# Altium schematic sheet [02] - Module Connector.SchDoc: Module Connector
size A3; Date: N.A.; ApprovedBy: N.A.; CheckedBy: N.A.; Author: N.A.; CompanyName: Johannes Berndorfer; DrawnBy: JBE; Organization: N.A.; Address1: Konrad Grefe Gasse 22; Address2: 1230 Wien; Address3: AUSTRIA; Address4: N.A.; DocumentNumber: 2; Revision: A; SheetNumber: 2; SheetTotal: 4; ProjectTitle: IntelliModule-Alpha Prototyping Baseboard; Reviewer: -; Time: N.A.; ImagePath: N.A.; Application_BuildNumber: N.A.
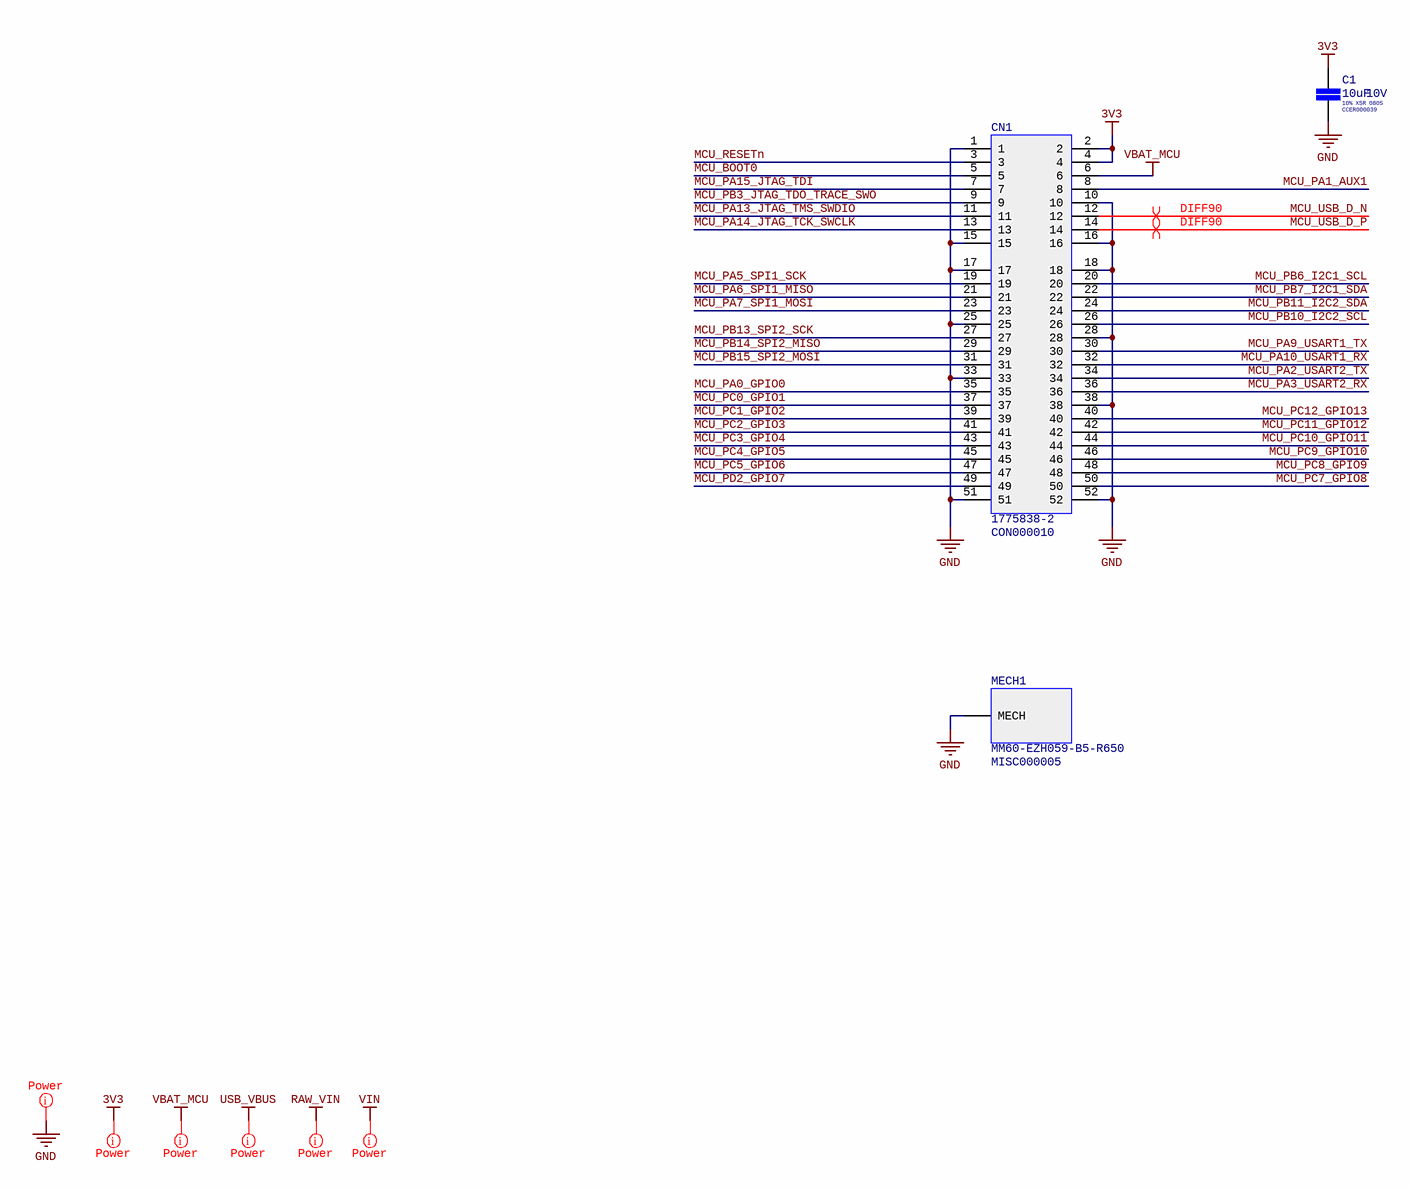
[diagram p0: [02] - Module Connector.SchDoc]

## Parts
C1  Internal Part Number: CCER000039  Tolerance: 10%  Voltage Rating: 10V  Dielectric: X5R  Case/Package: 0805  Capacitance: 10uF  [CAP-SMD-0805-1.35MM-IPC-MED]  (hidden comment: 10uF 10V)
CN1  1775838-2  Internal Part Number: CON000010  [CON-SMD-PCIE-MINI-52POS-1775838-2-TE]
MECH1  MM60-EZH059-B5-R650  Internal Part Number: MISC000005  [CON-SMD-PCIE-MINI-LATCH-0POS-MM60-EZH059-B5-R650-JAE]

## Nets
3V3: C1.1 CN1.2 CN1.4
GND: C1.2 CN1.1 CN1.10 CN1.15 CN1.16 CN1.17 CN1.18 CN1.25 CN1.28 CN1.33 CN1.38 CN1.51 CN1.52 MECH1.0(MECH)
VBAT_MCU: CN1.6
MCU_BOOT0: CN1.5
MCU_PA0_GPIO0: CN1.35
MCU_PA1_AUX1: CN1.8
MCU_PA2_USART2_TX: CN1.34
MCU_PA3_USART2_RX: CN1.36
MCU_PA5_SPI1_SCK: CN1.19
MCU_PA6_SPI1_MISO: CN1.21
MCU_PA7_SPI1_MOSI: CN1.23
MCU_PA9_USART1_TX: CN1.30
MCU_PA10_USART1_RX: CN1.32
MCU_PA13_JTAG_TMS_SWDIO: CN1.11
MCU_PA14_JTAG_TCK_SWCLK: CN1.13
MCU_PA15_JTAG_TDI: CN1.7
MCU_PB3_JTAG_TDO_TRACE_SWO: CN1.9
MCU_PB6_I2C1_SCL: CN1.20
MCU_PB7_I2C1_SDA: CN1.22
MCU_PB10_I2C2_SCL: CN1.26
MCU_PB11_I2C2_SDA: CN1.24
MCU_PB13_SPI2_SCK: CN1.27
MCU_PB14_SPI2_MISO: CN1.29
MCU_PB15_SPI2_MOSI: CN1.31
MCU_PC0_GPIO1: CN1.37
MCU_PC1_GPIO2: CN1.39
MCU_PC2_GPIO3: CN1.41
MCU_PC3_GPIO4: CN1.43
MCU_PC4_GPIO5: CN1.45
MCU_PC5_GPIO6: CN1.47
MCU_PC7_GPIO8: CN1.50
MCU_PC8_GPIO9: CN1.48
MCU_PC9_GPIO10: CN1.46
MCU_PC10_GPIO11: CN1.44
MCU_PC11_GPIO12: CN1.42
MCU_PC12_GPIO13: CN1.40
MCU_PD2_GPIO7: CN1.49
MCU_RESETn: CN1.3
MCU_USB_D_N: CN1.12
MCU_USB_D_P: CN1.14

## Layout directives
differential pair; differential pair class DIFF90: MCU_USB_D_N, MCU_USB_D_P
net class Power: 3V3, GND, RAW_VIN, USB_VBUS, VBAT_MCU, VIN

## Notes on the sheet
- Labels drawn without touching a wire or pin: 3V3, GND, RAW_VIN, USB_VBUS, VBAT_MCU, VIN
- Title:
- Project:
- Document Nr.:
- Revision:
- Date:
- Drawn By:
- Time:
- Reviewed By:
- Sheet
- of
- Size:
- A3
- Variant:
- File:

## Library data of the parts
C1 = CL21A106KPFNNNG: CAP CER 10U 10V X5R 10% SMD 0805 85C SAMSUNG; Supplier 1: Digi-Key; Manufacturer 1: Samsung; Manufacturer Part Number 1: CL21A106KPFNNNG; Stock 1: 884042; Pricing 1: 1=0,14000, 10=0,10000, 100=0,04690, 500=0,03290, 1000=0,02724 (USD); RoHS: Yes; Mount: Surface Mount; Case Code (Metric): 2012; Case Code (Imperial): 0805; Min Operating Temperature: -55°C; Max Operating Temperature: 85°C; Voltage: 10V; Packaging: Tape and Reel; Package Quantity: 3000; Termination: Wraparound; Length: 2mm; Height: 1.25mm; Depth: 1.25mm; Width: 0.049inch; Thickness: 0.053inch; Radiation Hardening: No; Lead Free: Lead Free; ComponentLink1URL: https://datasheet.ciiva.com/16428/cl21a106kpfnnng-16428896.pdf?src-supplier=Future+Electronics; ComponentLink1Description: https://datasheet.ciiva.com/16428/cl21a106kpfnnng-16428896.pdf?src-supplier=Future+Electronics; ComponentLink2URL: https://datasheet.ciiva.com/26936/getdatasheetpartid-640497-26936900.pdf?src-supplier=Verical; ComponentLink2Description: https://datasheet.ciiva.com/26936/getdatasheetpartid-640497-26936900.pdf?src-supplier=Verical; Supplier Part Number 1: 1276-6456-1-ND
CN1 = 1775838-2: CON MINI PCIE CARD EDGE 52POS SMD; Manufacturer 1: TE Connectivity AMP; Connector Type: Receptacle; High Temperature Housing: Yes; Number of Positions: 52; PCB Mount Retention: Without; PCB Mounting Orientation: Vertical; Stackable: No; Pitch: 0.8mm; Row Spacing: 0.031inch; Stack Height: 5.6mm; Supplier 1: Digi-Key; Manufacturer Part Number 1: 1775838-2; Stock 1: 12692; Pricing 1: 1=0,76000, 10=0,67100, 25=0,63160, 50=0,60520, 100=0,57880, 250=0,52620 (USD); RoHS: Yes; Mount: Surface Mount; Contact Plating: Gold; Contact Material: Copper Alloy; Housing Color: Black; Housing Material: Thermoplastic; Number of Rows: 2; Packaging: Tape and Reel; Termination: Solder; Orientation: Right Angle; Package Quantity: 500; Lead Free: Lead Free; ELV: Compliant; Flammability Rating: UL94 V-0; ComponentLink1URL: https://datasheet.ciiva.com/16468/eng-ds-8-1773459-7-express-mini-card-qrg-1011-16468375.pdf?src-supplier=Avnet+Asia; ComponentLink1Description: https://datasheet.ciiva.com/16468/eng-ds-8-1773459-7-express-mini-card-qrg-1011-16468375.pdf?src-supplier=Avnet+Asia; ComponentLink2URL: https://datasheet.ciiva.com/48777/eng-ds-8-1773459-7-express-mini-card-qrg-1011-48777258.pdf?src-supplier=Onlinecomponents.com; ComponentLink2Description: https://datasheet.ciiva.com/48777/eng-ds-8-1773459-7-express-mini-card-qrg-1011-48777258.pdf?src-supplier=Onlinecomponents.com; ComponentLink3URL: https://datasheet.ciiva.com/10924/eng-ds-8-1773459-7-express-mini-card-qrg-1011-10924539.pdf?src-supplier=Avnet; ComponentLink3Description: https://datasheet.ciiva.com/10924/eng-ds-8-1773459-7-express-mini-card-qrg-1011-10924539.pdf?src-supplier=Avnet; Supplier Part Number 1: A123340CT-ND
MECH1 = MM60-EZH059-B5-R650: CARD LATCH MINI PCIE 3.05mm HEIGHT; Manufacturer: JAE Electronics; Contact Resistance: 55mR; Current Rating: 500mA; Mating Cycles: 50; Supplier 1: Digi-Key; Manufacturer Part Number: MM60-EZH059-B5-R650; Stock 1: 14566; Pricing 1: 1 = 1,22000, 10 = 1,07500, 25 = 1,01160, 50 = 0,96940, 100 = 0,92720, 250 = 0,84296 (USD); RoHS: Yes; Mount: Socket; Case/Package: SMD/SMT; Contact Material: Stainless Steel,Tin; Contact Plating: Tin; Min Operating Temperature: -40°C; Max Operating Temperature: 80°C; Packaging: Tape and Reel; Package Quantity: 1; Termination: Solder; Height: 5.9mm; REACH SVHC: Unknown; Flammability Rating: UL94 V-0; ComponentLink1URL: https://datasheet.ciiva.com/682/sj105221-682461.pdf?src-supplier=Digi-Key; ComponentLink1Description: https://datasheet.ciiva.com/682/sj105221-682461.pdf?src-supplier=Digi-Key; ComponentLink2URL: https://datasheet.ciiva.com/7655/332202-7655815.pdf?src-supplier=Element14; ComponentLink2Description: https://datasheet.ciiva.com/7655/332202-7655815.pdf?src-supplier=Element14; Supplier Part Number 1: 670-2277-1-ND